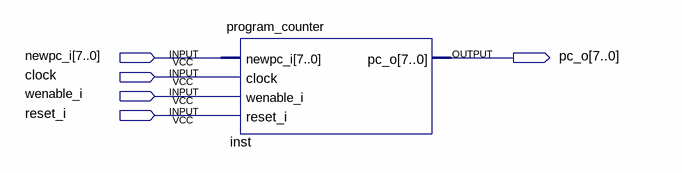
[diagram p0: schematic sheet]
// Quartus schematic WalkThrough.bdf as structural Verilog: 1 symbols, 5 pins
module WalkThrough (
  input  [7:0] newpc_i,
  input  clock,
  input  wenable_i,
  input  reset_i,
  output [7:0] pc_o
);

  program_counter inst (.newpc_i(newpc_i), .clock(clock), .wenable_i(wenable_i), .reset_i(reset_i), .pc_o(pc_o));
endmodule
